# EAGLE design Drivers (EAGLE 9.0.1)
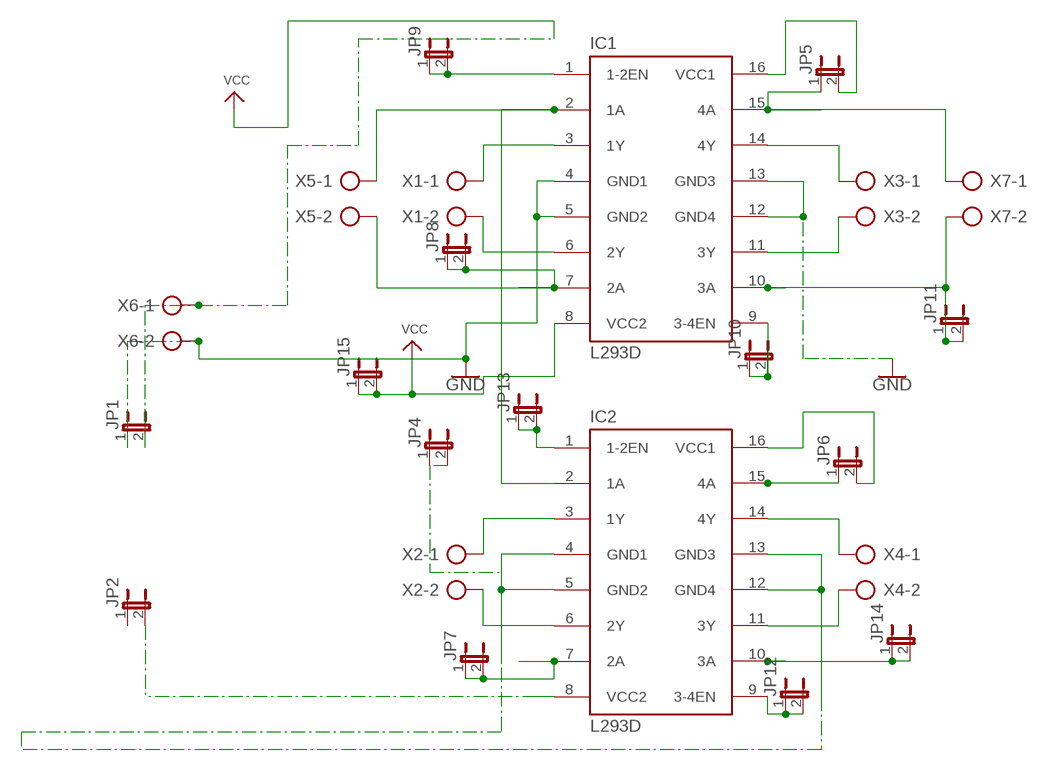
[diagram p0: schematic, sheet 1]

## Parts
IC1  L293D  [DIL16]
IC2  L293D  [DIL16]
JP1  JP1E  [JP1]
JP2  JP1E  [JP1]
JP4  JP1E  [JP1]
JP5  JP1E  [JP1]
JP6  JP1E  [JP1]
JP7  JP1E  [JP1]
JP8  JP1E  [JP1]
JP9  JP1E  [JP1]
JP10  JP1E  [JP1]
JP11  JP1E  [JP1]
JP12  JP1E  [JP1]
JP13  JP1E  [JP1]
JP14  JP1E  [JP1]
JP15  JP1E  [JP1]
X1  AK500/2-H  [AK500/2-H]
X2  AK500/2-H  [AK500/2-H]
X3  AK500/2-H  [AK500/2-H]
X4  AK500/2-H  [AK500/2-H]
X5  AK500/2-H  [AK500/2-H]
X6  AK500/2-H  [AK500/2-H]
X7  AK500/2-H  [AK500/2-H]

## Nets
GND: IC1.4(GND1) IC1.5(GND2) IC1.12(GND4) IC1.13(GND3) JP1.1 X6.2
N$1: IC2.10(3A) JP14.1 JP14.2
N$2: IC2.7(2A) JP7.1 JP7.2
N$4: IC1.7(2A) JP8.1 JP8.2 X5.2
N$5: IC1.3(1Y) X1.1
N$6: IC1.6(2Y) X1.2
N$7: IC2.3(1Y) X2.1
N$8: IC2.6(2Y) X2.2
N$9: IC1.11(3Y) X3.2
N$10: IC1.14(4Y) X3.1
N$11: IC2.11(3Y) X4.2
N$12: IC2.14(4Y) X4.1
N$13: IC1.2(1A) IC2.2(1A) X5.1
N$14: IC2.15(4A) JP6.1
N$15: IC1.10(3A) JP11.1 JP11.2 X7.2
N$16: IC1.1(1-2EN) JP9.1 JP9.2
N$17: IC2.8(VCC2) JP2.2
N$18: IC2.4(GND1) IC2.5(GND2) IC2.12(GND4) IC2.13(GND3) JP4.1 JP4.2
N$19: IC1.15(4A) JP5.1 X7.1
N$20: IC1.9(3-4EN) JP10.1 JP10.2
N$21: IC2.9(3-4EN) JP12.1 JP12.2
N$22: IC2.1(1-2EN) JP13.1 JP13.2
N$23: IC2.16(VCC1) JP6.2
N$24: IC1.16(VCC1) JP5.2
VCC: IC1.8(VCC2) JP1.2 JP15.1 JP15.2 X6.1
Unconnected: JP2.1

## Library data of the parts
IC1 IC2 = st-microelectronics:L293D: PUSH-PULL 4 CHANNEL DRIVER; MPN: L293D; OC_FARNELL: 9589619; OC_NEWARK: 56P8249
JP1 JP2 JP4-JP15 = jumper:JP1E: JUMPER
X1-X7 = con-ptr500:AK500/2-H: CONNECTOR Aug. 2004 / PTR Meßtechnik: Die Bezeichnung der Serie AK505 wurde geändert. Es handelt sich hierbei um AK500 in horizontaler Ausführung.; OC_FARNELL: unknown; OC_NEWARK: unknown

## Board
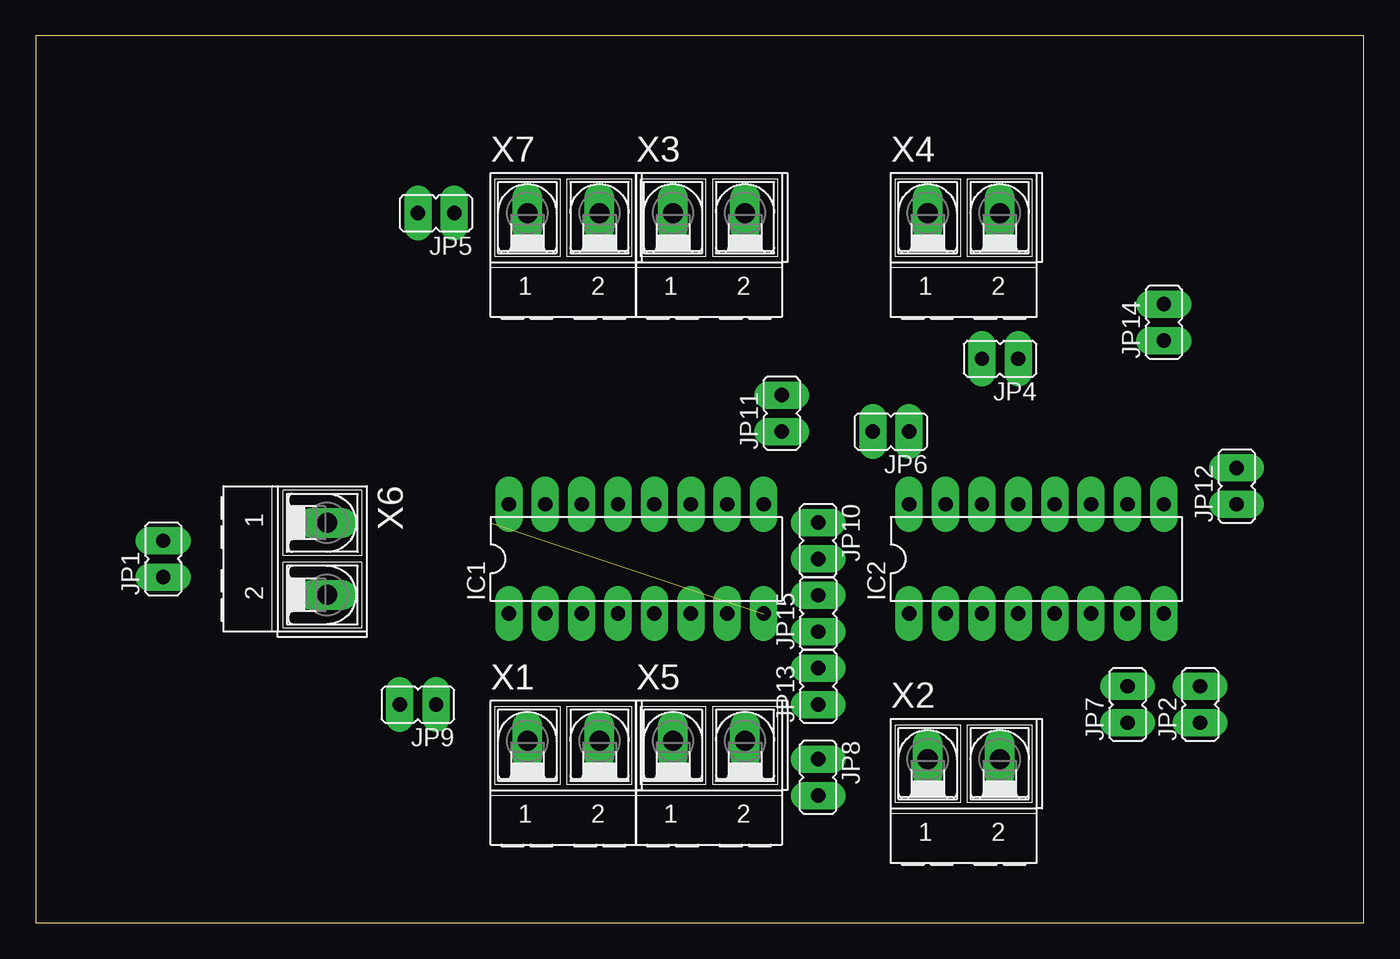
[diagram p1: board, top side]
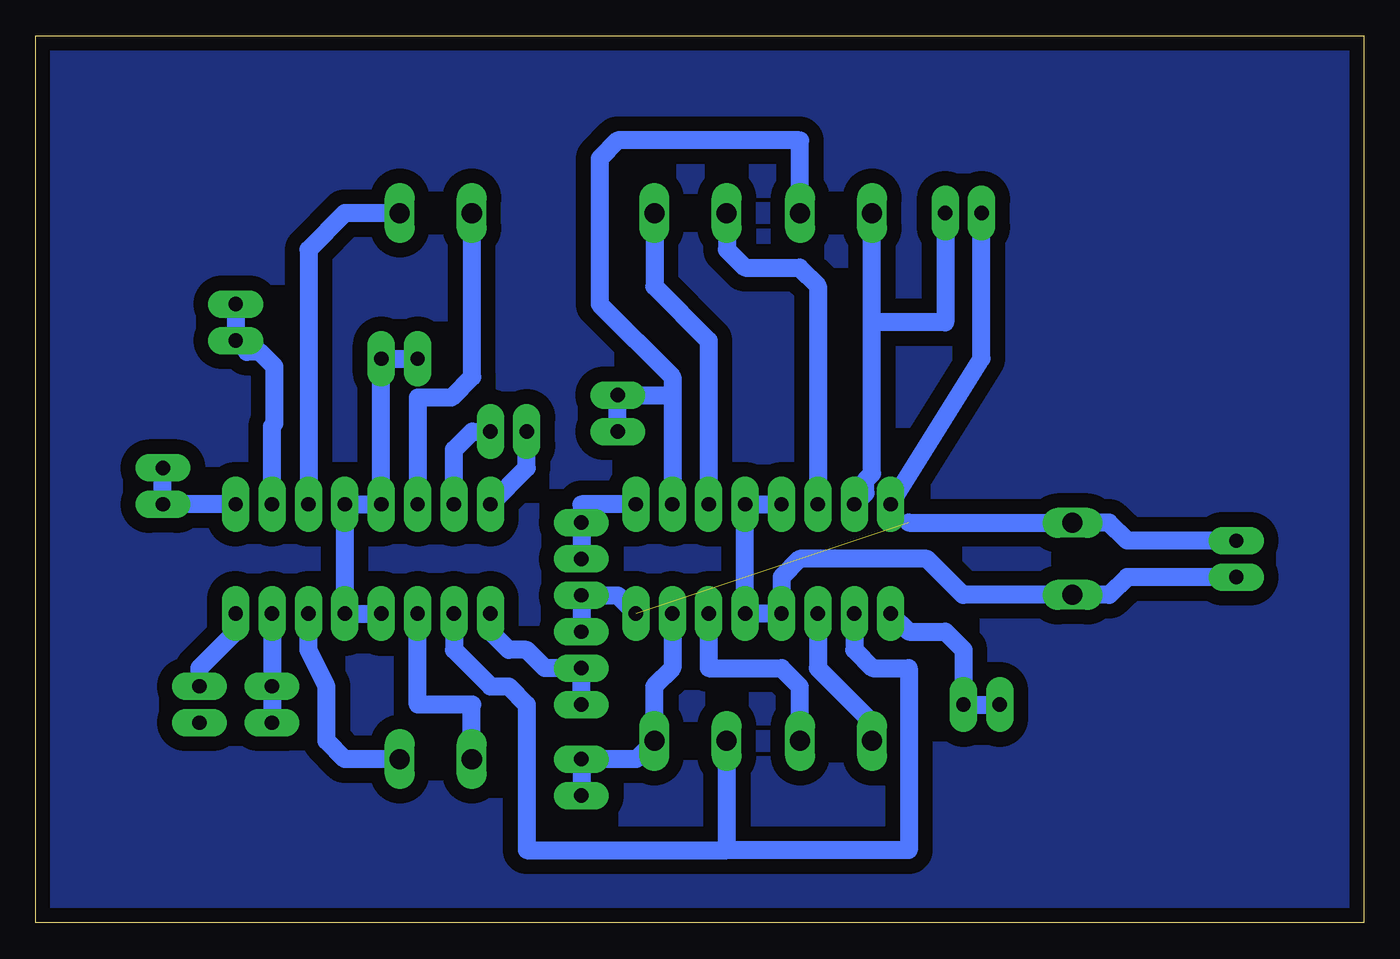
[diagram p2: board, bottom side, seen from below]

Size 92.69 x 61.9 mm. Coordinates in mm from the lower left corner, seen from the top.
Outline: 0,0 92.69,0 92.69,61.9 0,61.9 0,0
Copper layers (1*16): Top 0.035mm / dielectric 1.5mm / Bottom 0.035mm
Design rules "default": minimum track width 6mil, minimum drill 0.35mm, track to track 6mil, track to pad 6mil, pad to pad 6mil, via to via 6mil, smd to smd 6mil, copper to edge 40mil, drill to drill 6mil, minimum pad ring 10mil, minimum via ring 8mil, stop-mask expansion 4mil, vias tented up to drill 0mil, thermal gap 10mil

### Footprints (pad centres in the part's own frame; a part is rotated, then mirrored left to right if it is on the bottom)
DIL16 = drill 1 pad 1.93 long: 1 -8.89,-3.81; 2 -6.35,-3.81; 3 -3.81,-3.81; 4 -1.27,-3.81; 5 1.27,-3.81; 6 3.81,-3.81; 7 6.35,-3.81; 8 8.89,-3.81; 9 8.89,3.81; 10 6.35,3.81; 11 3.81,3.81; 12 1.27,3.81; 13 -1.27,3.81; 14 -3.81,3.81; 15 -6.35,3.81; 16 -8.89,3.81
JP1 = drill 1 pad 1.93 long: 1 0,-1.27; 2 0,1.27
AK500/2-H = drill 1.4 pad 1.93 long: 1 -2.515,0; 2 2.515,0

### Placement (x,y rotation side)
IC1  41.91,25.4 0 top
IC2  69.85,25.4 0 top
JP1  8.89,25.4 0 top
JP2  81.28,15.24 0 top
JP4  67.31,39.37 90 top
JP5  27.94,49.53 90 top
JP6  59.69,34.29 90 top
JP7  76.2,15.24 0 top
JP8  54.61,10.16 180 top
JP9  26.67,15.24 90 top
JP10  54.61,26.67 180 top
JP11  52.07,35.56 0 top
JP12  83.82,30.48 0 top
JP13  54.61,16.51 0 top
JP14  78.74,41.91 0 top
JP15  54.61,21.59 0 top
X1  36.83,12.7 0 top
X2  64.77,11.43 0 top
X3  46.99,49.53 0 top
X4  64.77,49.53 0 top
X5  46.99,12.7 0 top
X6  20.32,25.4 270 top
X7  36.83,49.53 0 top

### Tracks (layer width: path | path; a pad name or v marks a point on that pad's centre or on a via)
GND
  Bottom 1.27: JP1.1 16.51,24.13 17.75,22.89 X6.2 27.96,22.89 30.48,25.4 39.37,25.4 40.64,24.13 IC1.4 IC1.5 IC1.12 IC1.13
N$1
  Bottom 1.27: IC2.10 76.2,34.66 76.02,34.83 76.02,38.83 77.05,39.85 77.95,39.85 JP14.1 JP14.2
N$2
  Bottom 1.27: IC2.7 JP7.2 JP7.1
N$3
  pour Bottom (isolate 1.016): 0,62.23 0,0 92.71,0 92.71,62.23
N$4
  Bottom 1.27: IC1.7 48.26,17.78 49.53,16.51 49.53,12.7 X5.2 50.77,11.43 JP8.1 JP8.2
N$5
  Bottom 1.27: IC1.3 38.1,17.78 34.31,13.99 X1.1
N$6
  Bottom 1.27: IC1.6 45.72,17.78 40.64,17.78 39.37,16.51 39.37,12.7 X1.2
N$7
  Bottom 1.27: X2.1 62.26,15.21 62.23,15.24 66.04,15.24 IC2.3
N$8
  Bottom 1.27: X2.2 71.12,11.43 72.39,12.7 72.39,16.51 73.66,19.05 IC2.6
N$9
  Bottom 1.27: X3.2 49.51,44.42 45.72,40.64 IC1.11
N$10
  Bottom 1.27: X3.1 44.45,49.51 44.45,46.99 43.18,45.72 39.37,45.72 38.1,44.45 IC1.14
N$11
  Bottom 1.27: X4.2 71.12,49.53 73.66,46.99 IC2.11
N$12
  Bottom 1.27: X4.1 62.26,38.12 62.23,38.1 63.68,36.65 66.04,36.65 IC2.14
N$13
  Bottom 1.27: IC1.2 35.56,19.05 34.29,17.78 31.75,17.78 31.75,5.08 44.45,5.08 | 44.45,5.08 44.45,12.68 X5.1 | IC2.2 63.5,19.05 60.96,16.51 59.69,16.51 58.42,15.24 58.42,5.08 44.45,5.08
N$14
  Bottom 1.27: IC2.15 63.5,33.02 62.23,34.29 JP6.1
N$15
  Bottom 1.27: X7.2 39.34,54.59 39.37,54.61 52.07,54.61 53.34,53.34 53.34,43.18 48.26,38.1 48.26,36.83 | 48.26,36.83 IC1.10 | JP11.1 JP11.2 48.26,36.83
N$16
  Bottom 1.27: IC1.1 31.75,20.32 29.21,20.32 27.94,19.05 JP9.1 JP9.2
N$17
  Bottom 1.27: IC2.8 78.74,20.32 81.28,17.78 JP2.2
N$18
  Bottom 1.27: IC2.4 IC2.5 IC2.12 IC2.13 JP4.1 JP4.2
N$19
  Bottom 1.27: IC1.15 34.77,30 34.77,30.9 34.31,31.36 34.31,41.91 | 34.31,41.91 X7.1 | JP5.1 29.21,41.91 34.31,41.91
N$20
  Bottom 1.27: IC1.9 54.61,29.21 JP10.1 JP10.2
N$21
  Bottom 1.27: IC2.9 JP12.1 JP12.2
N$22
  Bottom 1.27: JP13.1 JP13.2 57.15,17.78 58.42,19.05 59.69,19.05 60.96,20.32 IC2.1
N$23
  Bottom 1.27: IC2.16 58.42,31.75 JP6.2
N$24
  Bottom 1.27: IC1.16 26.67,39.37 JP5.2
VCC  (1 unrouted)
  Bottom 1.27: JP1.2 16.51,26.67 17.78,27.94 21.59,27.94 | 21.59,27.94 21.57,27.91 X6.1 | 31.75,27.94 21.59,27.94 | IC1.8 52.07,22.86 JP15.2 JP15.1